# EAGLE design 5V LINEAR REGULATOR BREAKOUT V00 (EAGLE 9.3.0)
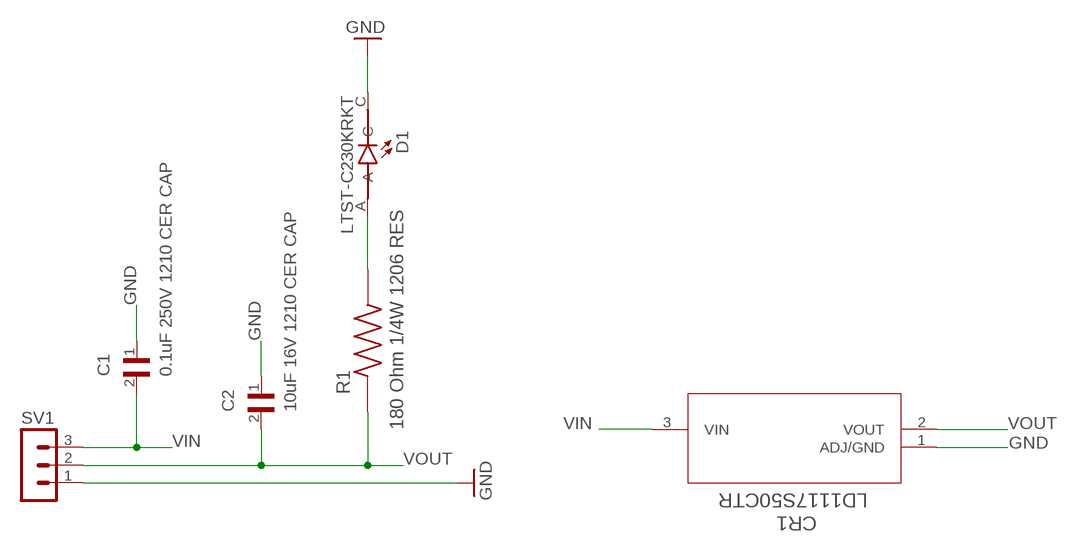
[diagram p0: schematic, sheet 1]

## Parts
C1  0.1uF 250V 1210 CER CAP  C1210C104K5RACTU  [CAPC3225X280]
C2  10uF 16V 1210 CER CAP  C1210C104K5RACTU  [CAPC3225X280]
CR1  LD1117S50CTR  [SOT-223_STM]
D1  LTST-C230KRKT  [LEDC3216X110]
R1  180 Ohm 1/4W 1206 RES  RC1206JR-0710KL  [RESC3116X65N]
SV1  MA03-1  [MA03-1]

## Nets
GND: C1.1 C2.1 CR1.1(ADJ/GND) D1.C SV1.1
N$1: D1.A R1.2
VIN: C1.2 CR1.3(VIN) SV1.3
VOUT: C2.2 CR1.2(VOUT) R1.1 SV1.2

## Library data of the parts
C1 C2 = C1210C104K5RACTU:C1210C104K5RACTU: KEMET C1210C104K5RACTU / CAPACITOR .1UF 50V 1210 CERAMI; DESCRIPTION: 0.1µF ±10% 50V Ceramic Capacitor X7R 1210 _3225 Metric_; DIGI-KEY_PART_NUMBER: 399-1267-1-ND; DIGI-KEY_PURCHASE_URL: https://www.digikey.com/product-detail/en/kemet/C1210C104K5RACTU/399-1267-1-ND/411542?utm_source=snapeda&utm_medium=aggregator&utm_campaign=symbol; MF: KEMET; MP: C1210C104K5RACTU; PACKAGE: 1210 KEMET
CR1 = LD1117S50CTR:LD1117S50CTR: IC REG LINEAR 5V 800MA SOT223; BUILT_BY: EMA_UL_Team; MANUFACTURER_PART_NUMBER: LD1117S50CTR; SOURCELIBRARY: Updates_to_database_2020-11-13; VENDOR: STMicroelectronics
D1 = LTST-C230KRKT:LTST-C230KRKT: LED SMT RED CLR 1206 TAPE; DESCRIPTION: Red 631nm LED Indication - Discrete 2V 1206 _3216 Metric_; DIGI-KEY_PART_NUMBER: 160-1457-1-ND; DIGI-KEY_PURCHASE_URL: https://www.digikey.com/product-detail/en/lite-on-inc/LTST-C230KRKT/160-1457-1-ND/386856?utm_source=snapeda&utm_medium=aggregator&utm_campaign=symbol; MF: Lite-On Inc.; MP: LTST-C230KRKT; PACKAGE: 1206 Lite-On
R1 = RC1206JR-0710KL:RC1206JR-0710KL: Res Thick Film 1206 10K Ohm 5% 0.25W(1/4W) ±100ppm/C Epoxy Pad SMD T/R; DESCRIPTION: 10 kOhms ±5% 0.25W, 1/4W Chip Resistor 1206 _3216 Metric_ Moisture Resistant Thick Film; DIGI-KEY_PART_NUMBER: 311-10KERCT-ND; DIGI-KEY_PURCHASE_URL: https://www.digikey.com/product-detail/en/yageo/RC1206JR-0710KL/311-10KERCT-ND/732156?utm_source=snapeda&utm_medium=aggregator&utm_campaign=symbol; MF: Yageo; MP: RC1206JR-0710KL; PACKAGE: 3116 Yageo
SV1 = con-lstb:MA03-1: PIN HEADER; OC_FARNELL: unknown; OC_NEWARK: unknown

## Board
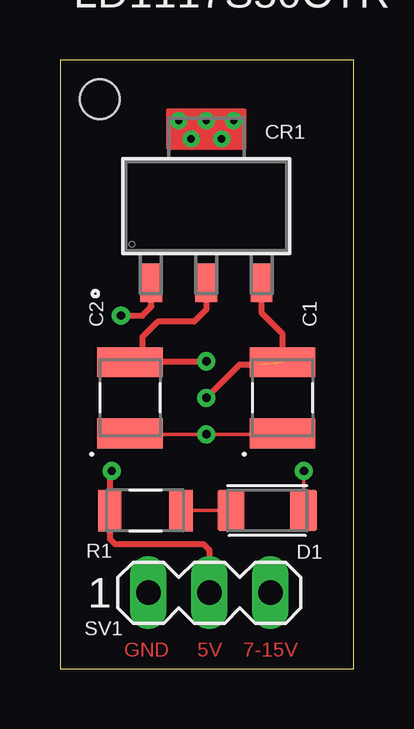
[diagram p1: board, top side]
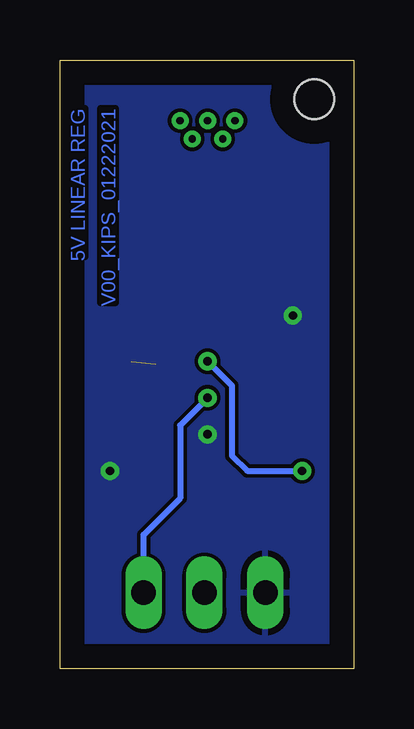
[diagram p2: board, bottom side, seen from below]

Size 12.24 x 25.39 mm. Coordinates in mm from the lower left corner, seen from the top.
Outline: 0,0 12.24,0 12.24,25.39 0,25.39 0,0
Copper layers (1*16): Top 0.035mm / dielectric 1.5mm / Bottom 0.035mm
Design rules "default": minimum track width 6mil, minimum drill 0.35mm, track to track 6mil, track to pad 6mil, pad to pad 6mil, via to via 6mil, smd to smd 6mil, copper to edge 40mil, drill to drill 6mil, minimum pad ring 10mil, minimum via ring 8mil, stop-mask expansion 4mil, vias tented up to drill 0mil, thermal gap 10mil
Holes 1.65 mm at 1.65,23.75

### Footprints (pad centres in the part's own frame; a part is rotated, then mirrored left to right if it is on the bottom)
CAPC3225X280 = smd 1.24 x 2.73: 1 -1.485,0; 2 1.485,0
SOT-223_STM = smd 0.914 x 1.6: 1 -2.3,-3.2; 2 0,-3.2; 3 2.3,-3.2
LEDC3216X110 = smd 1.1 x 1.73: A 1.51,0; C -1.51,0
RESC3116X65N = smd 0.97 x 1.73: 1 -1.48,0; 2 1.48,0
MA03-1 = drill 1.016 long: 1 -2.54,0; 2 0,0; 3 2.54,0

### Placement (x,y rotation side)
C1  9.27,11.3 90 top
C2  2.92,11.3 90 top
CR1  6.1,19.3 0 top
D1  8.64,6.6 180 top
R1  3.56,6.6 0 top
SV1  6.22,3.17 0 top

### Tracks (layer width: path | path; a pad name or v marks a point on that pad's centre or on a via)
GND  (via drill 0.35)
  Top 0.152: C2.1 2.96,9.78 v6.1,9.78 9.23,9.78 C1.1 | D1.C v10.16,8.25
  Top 0.254: 3.68,15.99 CR1.1 3.81,16.09 3.81,15.11 3.43,14.73 v2.54,14.73
  pour Bottom: -0.89,25.91 -0.89,-0.76 13.08,-0.76 13.08,25.91
N$1
  Top 0.152: R1.2 D1.A
N$2  (via drill 0.3)
  other vias: 4.95,22.86
N$3  (via drill 0.3)
  other vias: 6.1,22.86
N$4  (via drill 0.3)
  other vias: 7.24,22.86
N$5  (via drill 0.3)
  other vias: 6.73,22.1
N$6  (via drill 0.3)
  other vias: 5.46,22.1
VIN  (via drill 0.35)  (1 unrouted)
  Top 0.254: C1.2 9.27,13.97 8.4,14.84 CR1.3 | v6.1,11.3 7.49,12.7 8.25,12.7
  Bottom 0.254: SV1.3 8.76,5.59 7.24,7.11 7.24,10.16 v6.1,11.3
VOUT  (via drill 0.35)
  Top 0.152: v6.1,12.83 6.06,12.79 | v2.16,8.25 2.08,8.25
  Top 0.254: 6.06,12.79 3.43,12.79 | 3.43,12.79 C2.2 | 2.08,8.25 R1.1 2.08,5.42 2.29,5.21 5.97,5.21 6.22,4.95 SV1.2 | CR1.2 6.1,14.99 5.59,14.48 4.06,14.48 3.43,13.84 3.43,12.79
  Bottom 0.254: v6.1,12.83 5.08,11.81 5.08,8.89 4.45,8.25 v2.16,8.25

### Text on the board
Top: GND | 5V | 7-15V
Bottom: V00_KIPS_01222021 | 5V LINEAR REG